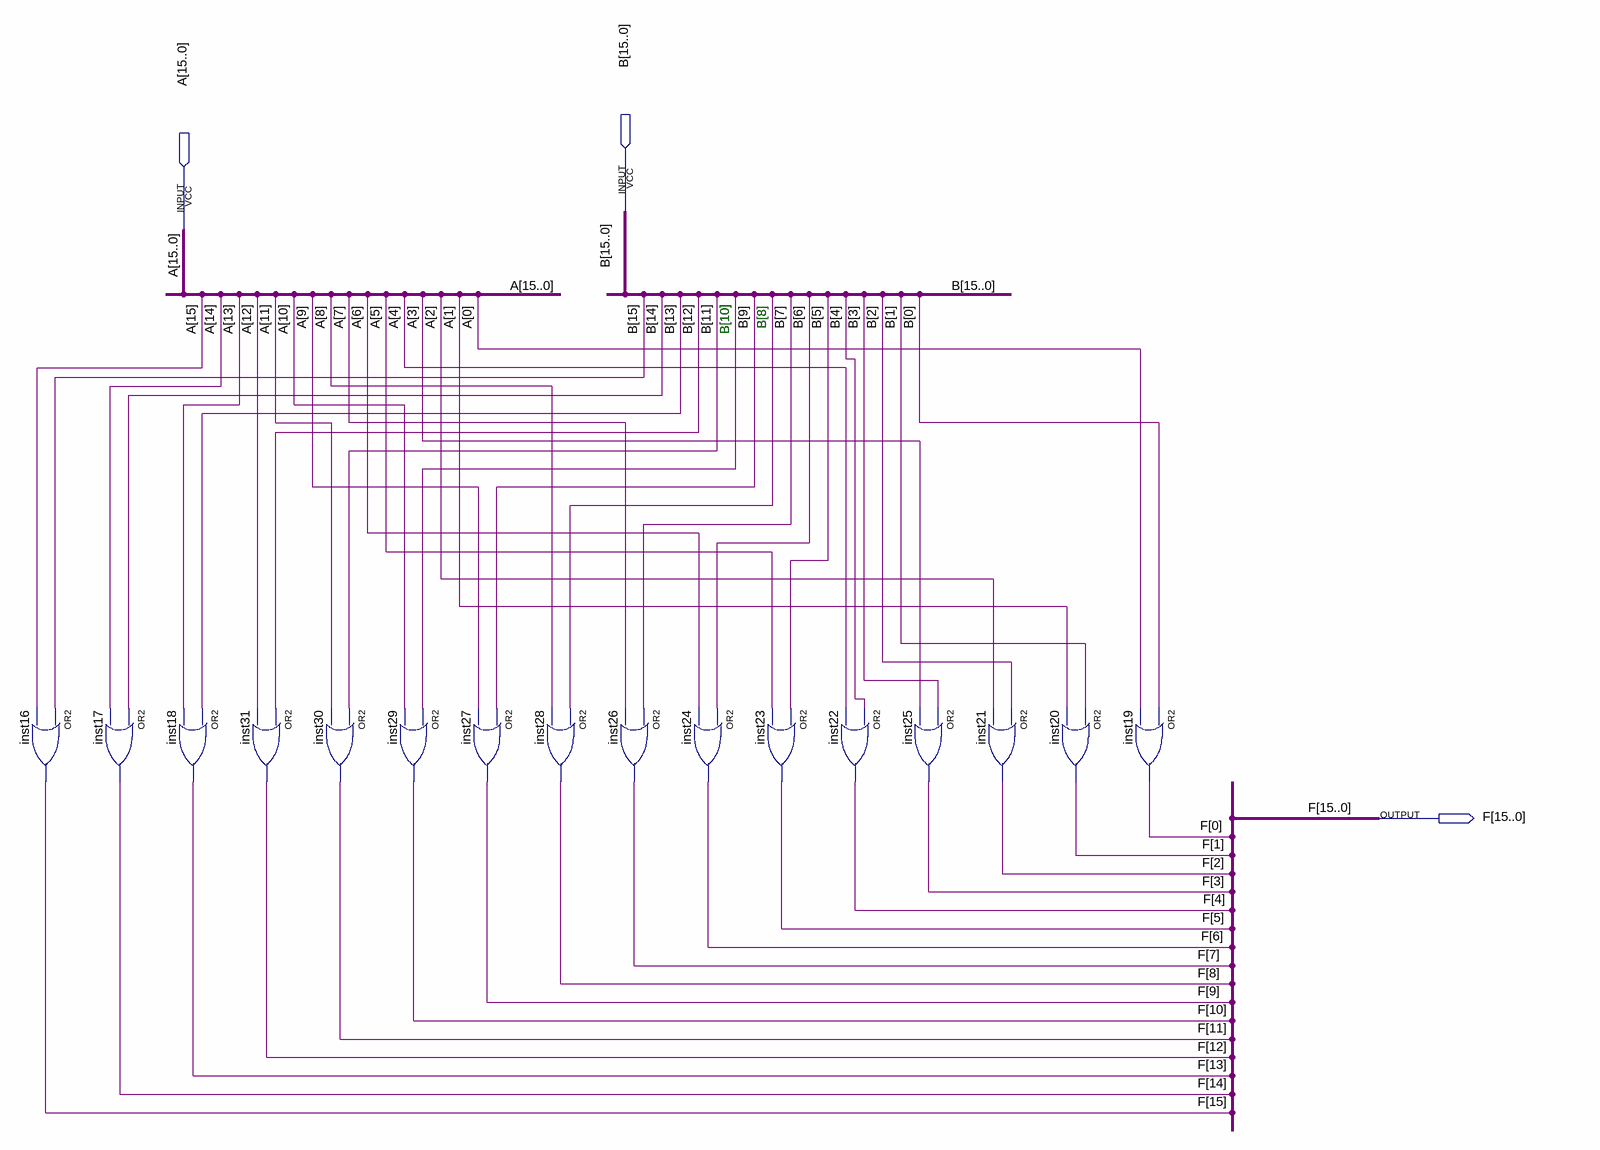
[diagram p0: schematic sheet]
// Quartus schematic ORR.bdf as structural Verilog: 16 symbols, 3 pins
module ORR (
  input  [15:0] B,
  input  [15:0] A,
  output [15:0] F
);

  or inst16 (F[15], B[15], A[15]);
  or inst17 (F[14], B[14], A[14]);
  or inst18 (F[13], B[13], A[13]);
  or inst31 (F[12], B[12], A[12]);
  or inst30 (F[11], B[11], A[11]);
  or inst29 (F[10], B[10], A[10]);
  or inst27 (F[9], B[9], A[9]);
  or inst28 (F[8], B[8], A[8]);
  or inst26 (F[7], B[7], A[7]);
  or inst24 (F[6], B[6], A[6]);
  or inst23 (F[5], B[5], A[5]);
  or inst22 (F[4], B[4], A[4]);
  or inst25 (F[3], B[3], A[3]);
  or inst21 (F[2], B[2], A[2]);
  or inst20 (F[1], B[1], A[1]);
  or inst19 (F[0], B[0], A[0]);

  // Notes on the sheet:
  //   B[10]
  //   B[8]
endmodule
